# EAGLE design tinyG2Hat (EAGLE 9.0.1)
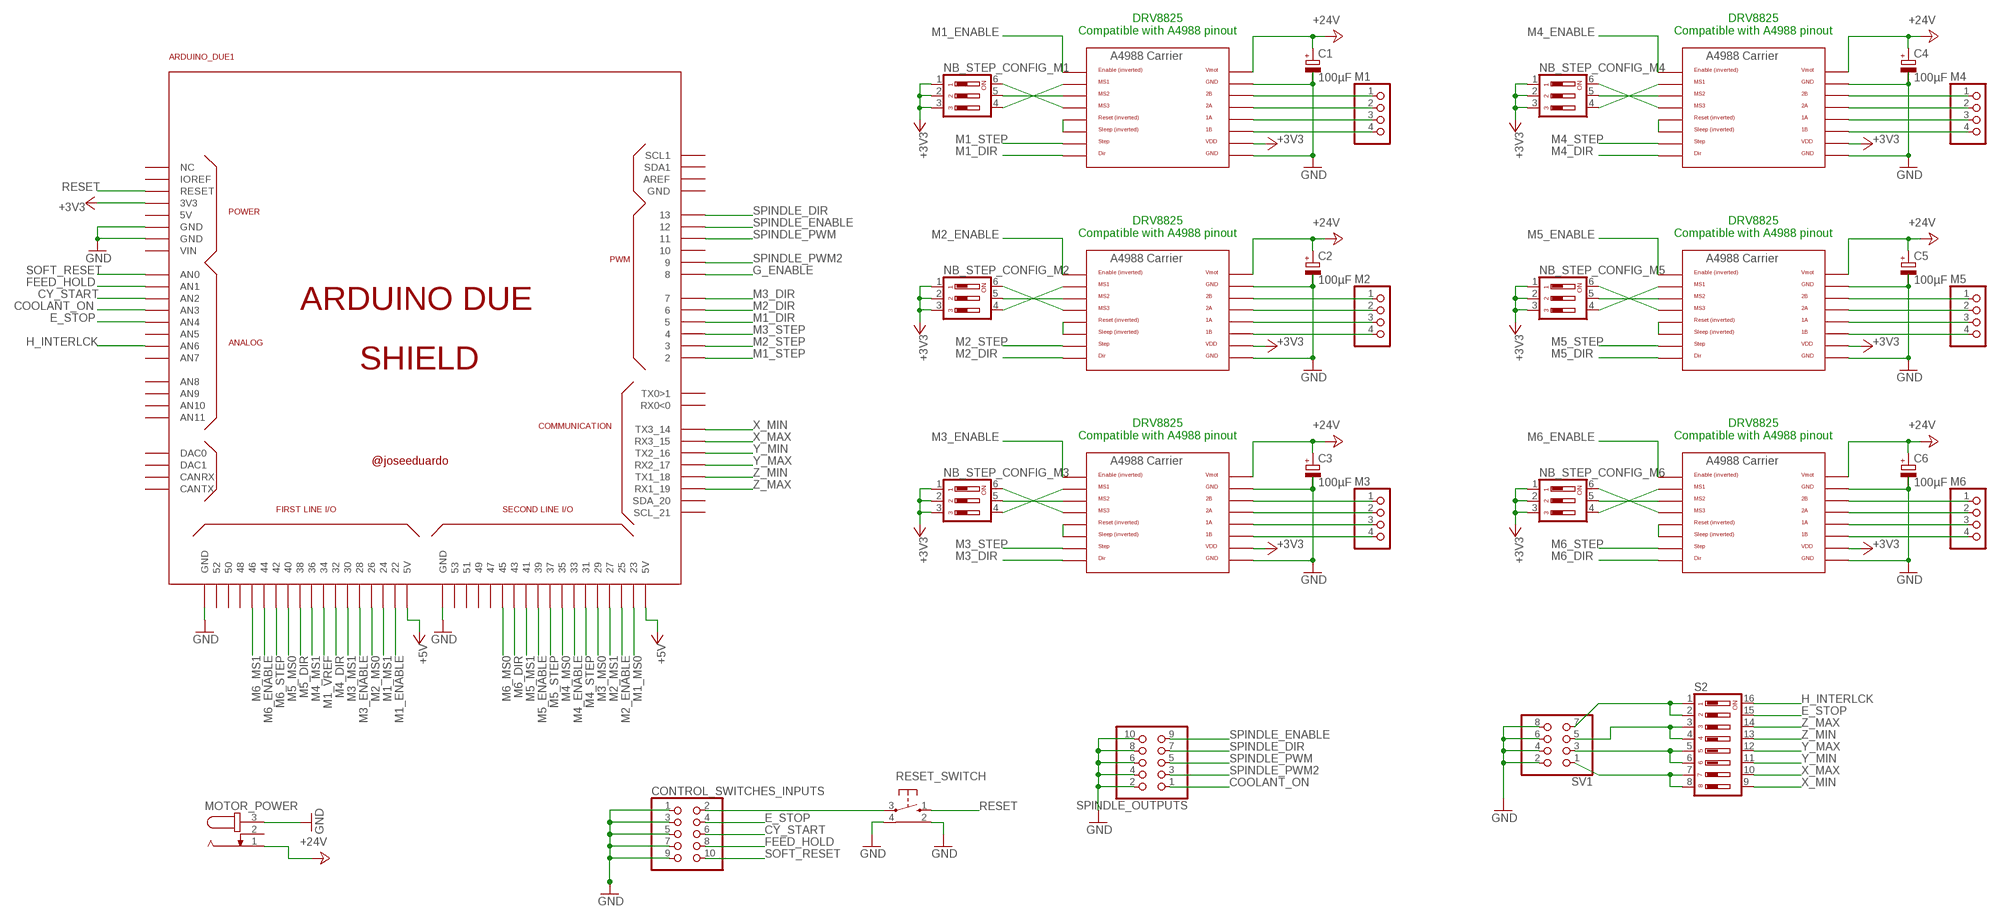
[diagram p0: schematic, sheet 1]

## Parts
ARDUINO_DUE1  ARDUINO_DUE_SHIELD_NOSPI  [ARDUINO_DUE_SHIELD_NOSPI]
C1  100µF  CPOL-EUE3.5-8  [E3,5-8]
C2  100µF  CPOL-EUE3.5-8  [E3,5-8]
C3  100µF  CPOL-EUE3.5-8  [E3,5-8]
C4  100µF  CPOL-EUE3.5-8  [E3,5-8]
C5  100µF  CPOL-EUE3.5-8  [E3,5-8]
C6  100µF  CPOL-EUE3.5-8  [E3,5-8]
CONTROL_SWITCHES_INPUTS  PINHD-2X5  [2X05]
M1  PINHD-1X4  [1X04]
M2  PINHD-1X4  [1X04]
M3  PINHD-1X4  [1X04]
M4  PINHD-1X4  [1X04]
M5  PINHD-1X4  [1X04]
M6  PINHD-1X4  [1X04]
MOTOR_POWER  RAPC7120  [RAPC712]
NB_STEP_CONFIG_M1  DIP03YL  [DIP03YL]
NB_STEP_CONFIG_M2  DIP03YL  [DIP03YL]
NB_STEP_CONFIG_M3  DIP03YL  [DIP03YL]
NB_STEP_CONFIG_M4  DIP03YL  [DIP03YL]
NB_STEP_CONFIG_M5  DIP03YL  [DIP03YL]
NB_STEP_CONFIG_M6  DIP03YL  [DIP03YL]
RESET_SWITCH  10-XX-RPAD  [B3F-10XX-RPAD]
S2  DIP08YL  [DIP08YL]
SPINDLE_OUTPUTS  PINHD-2X5  [2X05]
SV1  PINHD-2X4  [2X04]
U$1  A4988BREAKOUT  [A4988BREAKOUT]
U$2  A4988BREAKOUT  [A4988BREAKOUT]
U$3  A4988BREAKOUT  [A4988BREAKOUT]
U$4  A4988BREAKOUT  [A4988BREAKOUT]
U$5  A4988BREAKOUT  [A4988BREAKOUT]
U$6  A4988BREAKOUT  [A4988BREAKOUT]

## Nets
+3V3: ARDUINO_DUE1.3V3 NB_STEP_CONFIG_M1.1 NB_STEP_CONFIG_M1.2 NB_STEP_CONFIG_M1.3 NB_STEP_CONFIG_M2.1 NB_STEP_CONFIG_M2.2 NB_STEP_CONFIG_M2.3 NB_STEP_CONFIG_M3.1 NB_STEP_CONFIG_M3.2 NB_STEP_CONFIG_M3.3 NB_STEP_CONFIG_M4.1 NB_STEP_CONFIG_M4.2 NB_STEP_CONFIG_M4.3 NB_STEP_CONFIG_M5.1 NB_STEP_CONFIG_M5.2 NB_STEP_CONFIG_M5.3 NB_STEP_CONFIG_M6.1 NB_STEP_CONFIG_M6.2 NB_STEP_CONFIG_M6.3 U$1.VDD U$2.VDD U$3.VDD U$4.VDD U$5.VDD U$6.VDD
+5V: ARDUINO_DUE1.5V0_1(5V) ARDUINO_DUE1.5V0_2(5V)
+24V: C1.+ C2.+ C3.+ C4.+ C5.+ C6.+ MOTOR_POWER.1 U$1.VMOT U$2.VMOT U$3.VMOT U$4.VMOT U$5.VMOT U$6.VMOT
COOLANT_ON: ARDUINO_DUE1.A3(AN3) SPINDLE_OUTPUTS.1
CY_START: ARDUINO_DUE1.A2(AN2) CONTROL_SWITCHES_INPUTS.6
E_STOP: ARDUINO_DUE1.A4(AN4) CONTROL_SWITCHES_INPUTS.4 S2.15
FEED_HOLD: ARDUINO_DUE1.A1(AN1) CONTROL_SWITCHES_INPUTS.8
G_ENABLE: ARDUINO_DUE1.8
GND: ARDUINO_DUE1.GND ARDUINO_DUE1.GND_1(GND) ARDUINO_DUE1.GND_2(GND) ARDUINO_DUE1.GND_3(GND) C1.- C2.- C3.- C4.- C5.- C6.- CONTROL_SWITCHES_INPUTS.1 CONTROL_SWITCHES_INPUTS.3 CONTROL_SWITCHES_INPUTS.5 CONTROL_SWITCHES_INPUTS.7 CONTROL_SWITCHES_INPUTS.9 MOTOR_POWER.3 RESET_SWITCH.2(GND1) RESET_SWITCH.4(GND2) SPINDLE_OUTPUTS.2 SPINDLE_OUTPUTS.4 SPINDLE_OUTPUTS.6 SPINDLE_OUTPUTS.8 SPINDLE_OUTPUTS.10 SV1.2 SV1.4 SV1.6 SV1.8 U$1.GND U$1.GND@0(GND) U$2.GND U$2.GND@0(GND) U$3.GND U$3.GND@0(GND) U$4.GND U$4.GND@0(GND) U$5.GND U$5.GND@0(GND) U$6.GND U$6.GND@0(GND)
H_INTERLCK: ARDUINO_DUE1.A6(AN6) S2.16
M1_DIR: ARDUINO_DUE1.5 U$1.DIR
M1_ENABLE: ARDUINO_DUE1.22 U$1.EN
M1_MS0: ARDUINO_DUE1.23
M1_MS1: ARDUINO_DUE1.24
M1_STEP: ARDUINO_DUE1.2 U$1.STEP
M1_VREF: ARDUINO_DUE1.34
M2_DIR: ARDUINO_DUE1.6 U$2.DIR
M2_ENABLE: ARDUINO_DUE1.25 U$2.EN
M2_MS0: ARDUINO_DUE1.26
M2_MS1: ARDUINO_DUE1.27
M2_STEP: ARDUINO_DUE1.3 U$2.STEP
M3_DIR: ARDUINO_DUE1.7 U$3.DIR
M3_ENABLE: ARDUINO_DUE1.28 U$3.EN
M3_MS0: ARDUINO_DUE1.29
M3_MS1: ARDUINO_DUE1.30
M3_STEP: ARDUINO_DUE1.4 U$3.STEP
M4_DIR: ARDUINO_DUE1.32 U$4.DIR
M4_ENABLE: ARDUINO_DUE1.33 U$4.EN
M4_MS0: ARDUINO_DUE1.35
M4_MS1: ARDUINO_DUE1.36
M4_STEP: ARDUINO_DUE1.31 U$4.STEP
M5_DIR: ARDUINO_DUE1.38 U$5.DIR
M5_ENABLE: ARDUINO_DUE1.39 U$5.EN
M5_MS0: ARDUINO_DUE1.40
M5_MS1: ARDUINO_DUE1.41
M5_STEP: ARDUINO_DUE1.37 U$5.STEP
M6_DIR: ARDUINO_DUE1.43 U$6.DIR
M6_ENABLE: ARDUINO_DUE1.44 U$6.EN
M6_MS0: ARDUINO_DUE1.45
M6_MS1: ARDUINO_DUE1.46
M6_STEP: ARDUINO_DUE1.42 U$6.STEP
N$1: NB_STEP_CONFIG_M1.6 U$1.MS3
N$2: NB_STEP_CONFIG_M1.5 U$1.MS2
N$3: NB_STEP_CONFIG_M1.4 U$1.MS1
N$4: U$1.RST U$1.SLP(SLEEP)
N$5: M1.1 U$1.2B
N$6: M1.2 U$1.2A
N$7: M1.3 U$1.1A
N$8: M1.4 U$1.1B
N$9: NB_STEP_CONFIG_M2.5 U$2.MS2
N$10: U$2.RST U$2.SLP(SLEEP)
N$11: M2.1 U$2.2B
N$12: M2.2 U$2.2A
N$13: M2.3 U$2.1A
N$14: M2.4 U$2.1B
N$15: NB_STEP_CONFIG_M2.6 U$2.MS3
N$16: NB_STEP_CONFIG_M2.4 U$2.MS1
N$17: NB_STEP_CONFIG_M3.5 U$3.MS2
N$18: U$3.RST U$3.SLP(SLEEP)
N$19: M3.1 U$3.2B
N$20: M3.2 U$3.2A
N$21: M3.3 U$3.1A
N$22: M3.4 U$3.1B
N$23: NB_STEP_CONFIG_M3.6 U$3.MS3
N$24: NB_STEP_CONFIG_M3.4 U$3.MS1
N$25: NB_STEP_CONFIG_M4.5 U$4.MS2
N$26: U$4.RST U$4.SLP(SLEEP)
N$27: M4.1 U$4.2B
N$28: M4.2 U$4.2A
N$29: M4.3 U$4.1A
N$30: M4.4 U$4.1B
N$31: NB_STEP_CONFIG_M4.6 U$4.MS3
N$32: NB_STEP_CONFIG_M4.4 U$4.MS1
N$33: NB_STEP_CONFIG_M5.5 U$5.MS2
N$34: U$5.RST U$5.SLP(SLEEP)
N$35: M5.1 U$5.2B
N$36: M5.2 U$5.2A
N$37: M5.3 U$5.1A
N$38: M5.4 U$5.1B
N$39: NB_STEP_CONFIG_M5.6 U$5.MS3
N$40: NB_STEP_CONFIG_M5.4 U$5.MS1
N$41: NB_STEP_CONFIG_M6.5 U$6.MS2
N$42: U$6.RST U$6.SLP(SLEEP)
N$43: M6.1 U$6.2B
N$44: M6.2 U$6.2A
N$45: M6.3 U$6.1A
N$46: M6.4 U$6.1B
N$47: NB_STEP_CONFIG_M6.6 U$6.MS3
N$48: NB_STEP_CONFIG_M6.4 U$6.MS1
N$49: S2.1 S2.2 SV1.7
N$50: CONTROL_SWITCHES_INPUTS.2 RESET_SWITCH.3(P)
N$51: S2.3 S2.4 SV1.5
N$53: S2.5 S2.6 SV1.3
N$55: S2.7 S2.8 SV1.1
RESET: ARDUINO_DUE1.RESET RESET_SWITCH.1(S)
SOFT_RESET: ARDUINO_DUE1.A0(AN0) CONTROL_SWITCHES_INPUTS.10
SPINDLE_DIR: ARDUINO_DUE1.13 SPINDLE_OUTPUTS.7
SPINDLE_ENABLE: ARDUINO_DUE1.12 SPINDLE_OUTPUTS.9
SPINDLE_PWM: ARDUINO_DUE1.11 SPINDLE_OUTPUTS.5
SPINDLE_PWM2: ARDUINO_DUE1.9 SPINDLE_OUTPUTS.3
X_MAX: ARDUINO_DUE1.15(RX3_15) S2.10
X_MIN: ARDUINO_DUE1.14(TX3_14) S2.9
Y_MAX: ARDUINO_DUE1.17(RX2_17) S2.12
Y_MIN: ARDUINO_DUE1.16(TX2_16) S2.11
Z_MAX: ARDUINO_DUE1.19(RX1_19) S2.14
Z_MIN: ARDUINO_DUE1.18(TX1_18) S2.13
Unconnected: ARDUINO_DUE1.0(RX0<0) ARDUINO_DUE1.1(TX0>1) ARDUINO_DUE1.5V0(5V) ARDUINO_DUE1.10 ARDUINO_DUE1.20(SDA_20) ARDUINO_DUE1.21(SCL_21) ARDUINO_DUE1.47 ARDUINO_DUE1.48 ARDUINO_DUE1.49 ARDUINO_DUE1.50 ARDUINO_DUE1.51 ARDUINO_DUE1.52 ARDUINO_DUE1.53 ARDUINO_DUE1.A5(AN5) ARDUINO_DUE1.A7(AN7) ARDUINO_DUE1.A8(AN8) ARDUINO_DUE1.A9(AN9) ARDUINO_DUE1.A10(AN10) ARDUINO_DUE1.A11(AN11) ARDUINO_DUE1.AREF ARDUINO_DUE1.CANRX ARDUINO_DUE1.CANTX ARDUINO_DUE1.DAC0 ARDUINO_DUE1.DAC1 ARDUINO_DUE1.GND_4(GND) ARDUINO_DUE1.IOREF ARDUINO_DUE1.NC_2(NC) ARDUINO_DUE1.SCL1 ARDUINO_DUE1.SDA1 ARDUINO_DUE1.VIN MOTOR_POWER.2

## Notes on the sheet
- DRV8825
  Compatible with A4988 pinout
- DRV8825
  Compatible with A4988 pinout
- DRV8825
  Compatible with A4988 pinout
- DRV8825
  Compatible with A4988 pinout
- DRV8825
  Compatible with A4988 pinout
- DRV8825
  Compatible with A4988 pinout

## Library data of the parts
ARDUINO_DUE1 = arduino_due_shield:ARDUINO_DUE_SHIELD_NOSPI
C1-C6 = rcl:CPOL-EU: POLARIZED CAPACITOR, European symbol; SPICEPREFIX: C
CONTROL_SWITCHES_INPUTS SPINDLE_OUTPUTS = pinhead:PINHD-2X5: PIN HEADER
M1-M6 = pinhead:PINHD-1X4: PIN HEADER
MOTOR_POWER = RepRapjr:RAPC712: DC POWER JACK Power Jack, DC, Right Angle, Through Hole, Rated 5A at 16VDC, PC Terminals Distributor: Farnell (www.Farnell.de) Drawing: 84N1161.pdf / 84N1162.pdf Manufacturer: SPC Technology (www.spctechnology.com) Type: SPC4077 / SPC 4078
NB_STEP_CONFIG_M1-NB_STEP_CONFIG_M6 = switch-dil:DIP03YL: DIL/CODE SWITCH; OC_FARNELL: unknown; OC_NEWARK: unknown
RESET_SWITCH = RepRapjr:10-XX-RPAD: OMRON SWITCH
S2 = switch-dil:DIP08YL: DIL/CODE SWITCH; OC_FARNELL: unknown; OC_NEWARK: unknown
SV1 = pinhead:PINHD-2X4: PIN HEADER
U$1-U$6 = RepRapjr:A4988BREAKOUT

## Board
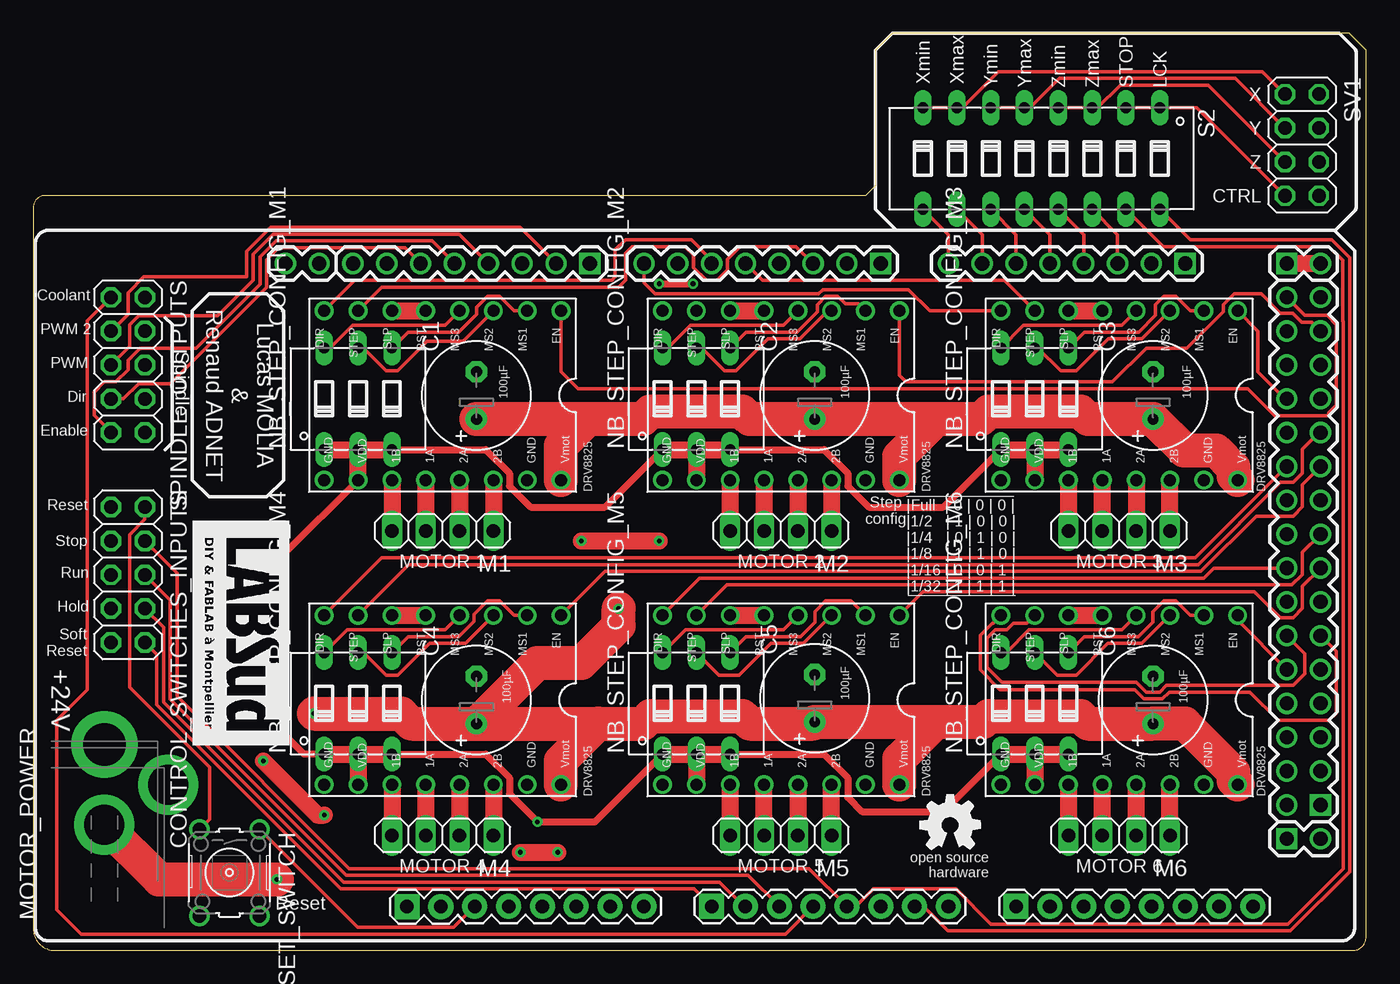
[diagram p1: board, top side]
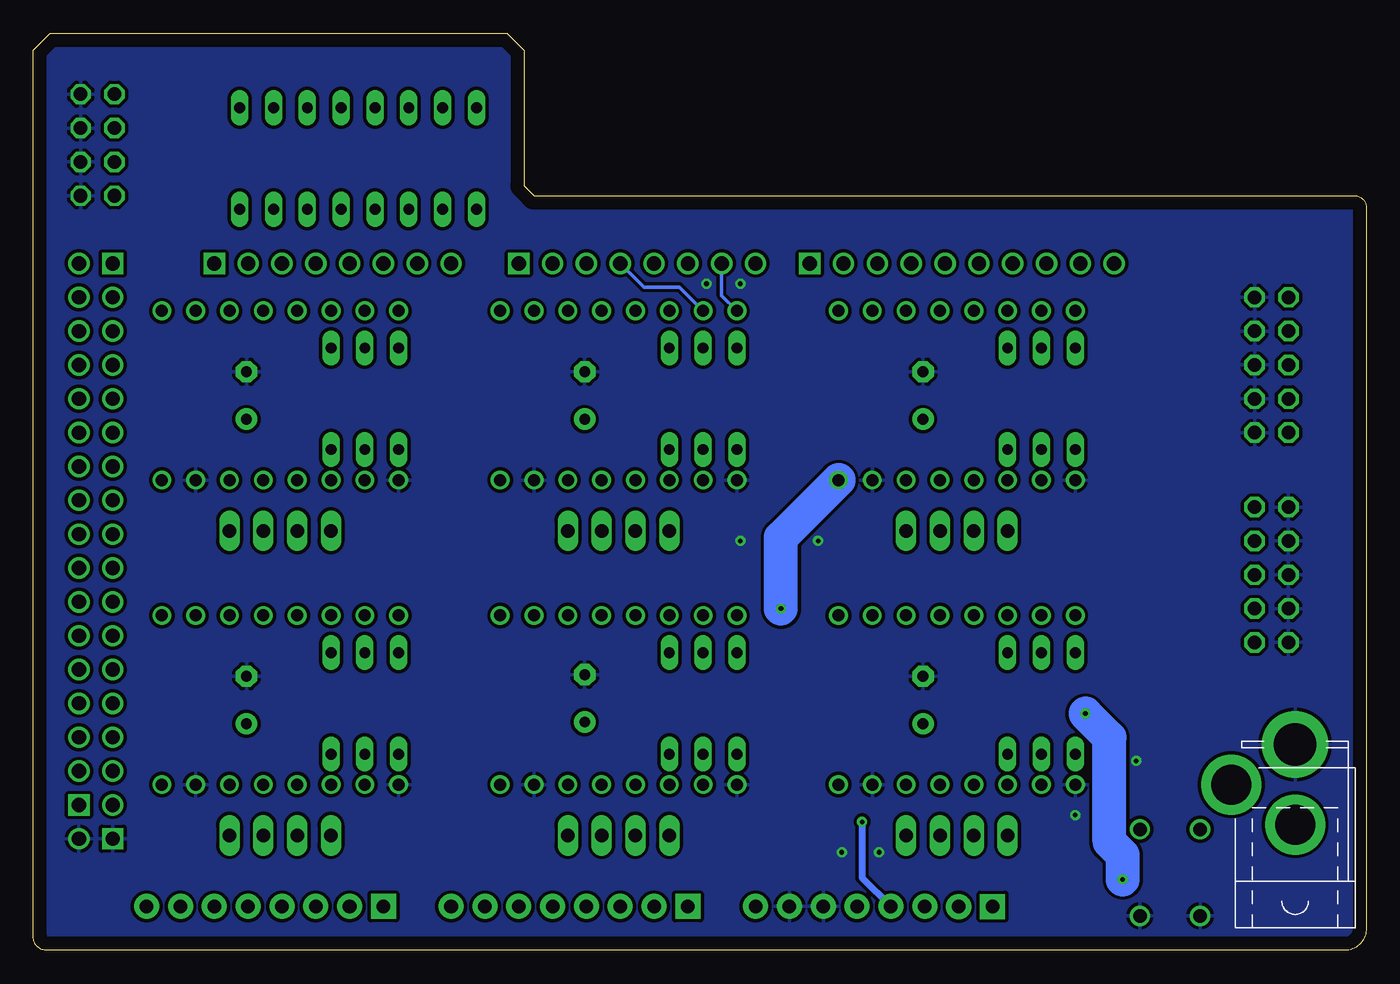
[diagram p2: board, bottom side, seen from below]

Size 100.08 x 68.84 mm. Coordinates in mm from the lower left corner, seen from the top.
Outline: 0,55.88 0,1.53 arc90 1.78,0 99.06,0 arc90 100.08,1.02 100.08,67.57 98.81,68.84 64.52,68.84 63.25,67.57 63.25,57.41 62.48,56.65 1.02,56.65 arc90 0,55.88
Copper layers (1*16): Top 0.035mm / dielectric 1.5mm / Bottom 0.035mm
Design rules "default *": minimum track width 6mil, minimum drill 0.35mm, track to track 10mil, track to pad 10mil, pad to pad 10mil, via to via 10mil, smd to smd 10mil, copper to edge 40mil, drill to drill 6mil, minimum pad ring 10mil, minimum via ring 8mil, stop-mask expansion 4mil, vias tented up to drill 0mil, thermal gap 10mil

### Footprints (pad centres in the part's own frame; a part is rotated, then mirrored left to right if it is on the bottom)
ARDUINO_DUE_SHIELD_NOSPI = drill 1.067 square: 0 63.373,51.816; 5V0_1 93.853,51.816; 8 41.529,51.816; 21 86.233,51.816; 53 96.393,11.176; GND_2 93.853,8.636 | drill 1.067: 1 60.833,51.816; 2 58.293,51.816; 3 55.753,51.816; 4 53.213,51.816; 5 50.673,51.816; 5V0_2 96.393,51.816; 6 48.133,51.816; 7 45.593,51.816; 9 38.989,51.816; 10 36.449,51.816; 11 33.909,51.816; 12 31.369,51.816; 13 28.829,51.816; 14 68.453,51.816; 15 70.993,51.816; 16 73.533,51.816; 17 76.073,51.816; 18 78.613,51.816; 19 81.153,51.816; 20 83.693,51.816; 22 93.853,49.276; 23 96.393,49.276; 24 93.853,46.736; 25 96.393,46.736; 26 93.853,44.196; 27 96.393,44.196; 28 93.853,41.656; 29 96.393,41.656; 30 93.853,39.116; 31 96.393,39.116; 32 93.853,36.576; 33 96.393,36.576; 34 93.853,34.036; 35 96.393,34.036; 36 93.853,31.496; 37 96.393,31.496; 38 93.853,28.956; 39 96.393,28.956; 40 93.853,26.416; 41 96.393,26.416; 42 93.853,23.876; 43 96.393,23.876; 44 93.853,21.336; 45 96.393,21.336; 46 93.853,18.796; 47 96.393,18.796; 48 93.853,16.256; 49 96.393,16.256; 50 93.853,13.716; 51 96.393,13.716; 52 93.853,11.176; AREF 23.749,51.816; GND_3 96.393,8.636; GND_4 26.289,51.816; SCL1 18.669,51.816; SDA1 21.209,51.816 | drill 1.016 pad 1.88: 3V3 35.433,3.556; 5V0 37.973,3.556; A1 53.213,3.556; A2 55.753,3.556; A3 58.293,3.556; A4 60.833,3.556; A5 63.373,3.556; A6 65.913,3.556; A7 68.453,3.556; A9 76.073,3.556; A10 78.613,3.556; A11 81.153,3.556; CANRX 88.773,3.556; CANTX 91.313,3.556; DAC0 83.693,3.556; DAC1 86.233,3.556; GND 40.513,3.556; GND_1 43.053,3.556; IOREF 30.346,3.543; RESET 32.893,3.555; VIN 45.593,3.556 | drill 1.016 pad 1.88 square: A0 50.673,3.556; A8 73.533,3.556; NC_2 27.806,3.543
E3,5-8 = drill 0.813 pad 1.6: + -1.778,0 | drill 0.813 pad 1.6 octagon: - 1.778,0
2X05 = drill 1.016 octagon: 1 -5.08,-1.27; 2 -5.08,1.27; 3 -2.54,-1.27; 4 -2.54,1.27; 5 0,-1.27; 6 0,1.27; 7 2.54,-1.27; 8 2.54,1.27; 9 5.08,-1.27; 10 5.08,1.27
1X04 = drill 1.016 long: 1 -3.81,0; 2 -1.27,0; 3 1.27,0; 4 3.81,0
RAPC712 = drill 3 pad 4.5: 1 -3,0; 2 0,-4.8 | drill 3.2 pad 5: 3 3,0
DIP03YL = drill 0.813 long: 1 -2.54,-3.81; 2 0,-3.81; 3 2.54,-3.81; 4 2.54,3.81; 5 0,3.81; 6 -2.54,3.81
B3F-10XX-RPAD = drill 1.016: 1 -3.251,2.261; 2 3.251,2.261; 3 -3.251,-2.261; 4 3.251,-2.261
DIP08YL = drill 0.813 long: 1 -8.89,-3.81; 2 -6.35,-3.81; 3 -3.81,-3.81; 4 -1.27,-3.81; 5 1.27,-3.81; 6 3.81,-3.81; 7 6.35,-3.81; 8 8.89,-3.81; 9 8.89,3.81; 10 6.35,3.81; 11 3.81,3.81; 12 1.27,3.81; 13 -1.27,3.81; 14 -3.81,3.81; 15 -6.35,3.81; 16 -8.89,3.81
2X04 = drill 1.016 octagon: 1 -3.81,-1.27; 2 -3.81,1.27; 3 -1.27,-1.27; 4 -1.27,1.27; 5 1.27,-1.27; 6 1.27,1.27; 7 3.81,-1.27; 8 3.81,1.27
A4988BREAKOUT = drill 0.9: 1A 8.89,1.27; 1B 11.43,1.27; 2A 6.35,1.27; 2B 3.81,1.27; DIR 16.51,-11.43; EN -1.27,-11.43; GND 16.51,1.27; GND@0 1.27,1.27; MS1 1.27,-11.43; MS2 3.81,-11.43; MS3 6.35,-11.43; RST 8.89,-11.43; SLP 11.43,-11.43; STEP 13.97,-11.43; VDD 13.97,1.27; VMOT -1.27,1.27

### Placement (x,y rotation side)
ARDUINO_DUE1  0.25,-0.25 0 top
C1  33.27,41.66 90 top
C2  58.67,41.66 90 top
C3  84.07,41.66 90 top
C4  33.27,18.8 90 top
C5  58.67,18.93 90 top
C6  84.07,18.8 90 top
CONTROL_SWITCHES_INPUTS  7.11,28.2 270 top
M1  30.73,31.5 180 top
M2  56.13,31.5 180 top
M3  81.53,31.5 180 top
M4  30.73,8.64 180 top
M5  56.13,8.64 180 top
M6  81.53,8.64 180 top
MOTOR_POWER  5.33,12.45 90 top
NB_STEP_CONFIG_M1  24.38,41.41 0 top
NB_STEP_CONFIG_M2  49.78,41.41 0 top
NB_STEP_CONFIG_M3  75.18,41.41 0 top
NB_STEP_CONFIG_M4  24.38,18.55 0 top
NB_STEP_CONFIG_M5  49.78,18.55 0 top
NB_STEP_CONFIG_M6  75.18,18.55 0 top
RESET_SWITCH  14.73,5.85 270 top
S2  75.69,59.44 180 top
SPINDLE_OUTPUTS  7.11,43.95 270 top
SV1  95.25,60.46 270 top
U$1  38.35,36.58 180 top
U$2  63.75,36.58 180 top
U$3  89.15,36.58 180 top
U$4  38.35,13.72 180 top
U$5  63.75,13.72 180 top
U$6  89.15,13.72 180 top
U$7  [OPEN_HARDWARE_5MM]  68.83,9.4 0 top
U$8  [LABSUD_15MM]  11.94,32.26 270 top

### Tracks (layer width: path | path; a pad name or v marks a point on that pad's centre or on a via)
+3V3  (via drill 0.35)
  Top 0.508: NB_STEP_CONFIG_M1.3 33.97,37.6 35.76,35.81 35.76,34.86 37.34,33.28 42.93,33.28 NB_STEP_CONFIG_M2.1 | NB_STEP_CONFIG_M2.3 59.37,37.6 61.16,35.81 61.16,34.86 62.74,33.28 68.33,33.28 NB_STEP_CONFIG_M3.1 | NB_STEP_CONFIG_M4.1 20.32,14.74 18.8,16.26 18.8,29.72 U$1.VDD | NB_STEP_CONFIG_M4.3 33.97,14.74 35.76,12.95 35.76,11.75 v37.85,9.66 42.16,9.66 NB_STEP_CONFIG_M5.1 | NB_STEP_CONFIG_M5.3 59.37,14.74 61.16,12.95 61.16,11.49 62.23,10.42 68.33,10.42 NB_STEP_CONFIG_M6.1
  Top 1.27: U$1.VDD NB_STEP_CONFIG_M1.2 | NB_STEP_CONFIG_M1.1 NB_STEP_CONFIG_M1.2 | NB_STEP_CONFIG_M1.2 NB_STEP_CONFIG_M1.3 | NB_STEP_CONFIG_M2.1 NB_STEP_CONFIG_M2.2 | NB_STEP_CONFIG_M2.2 NB_STEP_CONFIG_M2.3 | NB_STEP_CONFIG_M2.2 U$2.VDD | NB_STEP_CONFIG_M3.1 NB_STEP_CONFIG_M3.2 | NB_STEP_CONFIG_M3.2 NB_STEP_CONFIG_M3.3 | NB_STEP_CONFIG_M3.2 U$3.VDD | NB_STEP_CONFIG_M4.1 NB_STEP_CONFIG_M4.2 | NB_STEP_CONFIG_M4.2 NB_STEP_CONFIG_M4.3 | NB_STEP_CONFIG_M4.2 U$4.VDD | NB_STEP_CONFIG_M5.1 NB_STEP_CONFIG_M5.2 | NB_STEP_CONFIG_M5.2 NB_STEP_CONFIG_M5.3 | NB_STEP_CONFIG_M5.2 U$5.VDD | NB_STEP_CONFIG_M6.1 NB_STEP_CONFIG_M6.2 | NB_STEP_CONFIG_M6.2 NB_STEP_CONFIG_M6.3 | NB_STEP_CONFIG_M6.2 U$6.VDD
  Bottom 0.508: v37.85,9.66 37.85,5.47 ARDUINO_DUE1.3V3
+5V
  Top 1.27: ARDUINO_DUE1.5V0_1 ARDUINO_DUE1.5V0_2
+24V  (via drill 0.35)
  Top 2.54: 41.66,39.88 45.78,39.88 46.34,40.44 53.23,40.44 53.79,39.88 C2.+ 67.82,39.88 | 41.66,39.88 C1.+ | 67.82,39.88 71.18,39.88 71.74,40.44 78.63,40.44 79.19,39.88 C3.+ 86.42,37.54 88.81,37.54 90.11,36.23 90.11,35.62 U$3.VMOT | C4.+ 37.85,21.59 41.15,21.59 43.94,24.39 v43.94,25.66 | C4.+ 42.42,17.02 | 42.42,17.02 45.78,17.02 46.34,17.58 53.23,17.58 53.79,17.02 58.55,17.02 C5.+ 67.82,17.15 | U$6.VMOT 90.11,12.76 90.11,13.37 86.46,17.02 C6.+ 79.19,17.02 78.63,17.58 71.74,17.58 71.31,17.15 67.82,17.15 | MOTOR_POWER.1 9.45,5.34 v18.29,5.34 | C4.+ 28.39,17.02 27.63,17.78 v21.08,17.78 | U$1.VMOT 39.62,37.85 41.66,39.88 | U$2.VMOT 65.02,37.09 67.82,39.88 | U$4.VMOT 39.62,14.23 42.42,17.02 | U$5.VMOT 65.02,14.36 67.82,17.15
  Bottom 2.54: v18.29,5.34 18.29,7.16 19.28,8.15 19.28,15.98 v21.08,17.78 | v43.94,25.66 43.94,30.99 U$1.VMOT
COOLANT_ON
  Top 0.254: SPINDLE_OUTPUTS.1 4.06,47.25 4.06,19.56 1.78,17.28 1.78,3.05 3.61,1.22 56.46,1.22 ARDUINO_DUE1.A3
CY_START
  Top 0.254: CONTROL_SWITCHES_INPUTS.6 10.29,26.29 10.29,18.86 23.5,5.64 53.67,5.64 ARDUINO_DUE1.A2
E_STOP
  Top 0.254: CONTROL_SWITCHES_INPUTS.4 10.79,28.33 10.79,19.07 23.71,6.15 58.24,6.15 ARDUINO_DUE1.A4 61.76,3.31 63.08,4.63 69.25,4.63 71.9,1.99 94.18,1.99 98.34,6.14 98.34,47.19 98.3,47.22 98.3,51.82 97.28,52.84 84.84,52.84 S2.15
FEED_HOLD
  Top 0.254: CONTROL_SWITCHES_INPUTS.8 9.78,24.26 9.78,18.65 23.29,5.14 51.52,5.14 53.34,3.31 ARDUINO_DUE1.A1
GND  (via drill 0.35)
  Top 0.508: v46.99,50.04 v49.53,50.04
  Top 1.27: v17.27,14.23 21.34,10.16 v21.84,10.16 | v41.15,30.74 v46.99,30.74 | v36.58,7.37 v39.37,7.37
  pour Bottom: -5.59,78.24 -5.33,-3.04 104.39,-2.79 104.14,78.49
H_INTERLCK
  Top 0.254: ARDUINO_DUE1.A6 66.84,3.31 68.67,1.48 94.39,1.48 98.84,5.93 98.84,51.99 97.49,53.34 86.87,53.34 S2.16
M1_DIR
  Top 0.254: ARDUINO_DUE1.5 50.93,51.82 49.4,53.34 44.45,53.34 43.69,52.58 43.69,50.55 43.43,50.3 24.13,50.3 U$1.DIR
M1_ENABLE
  Top 0.254: U$1.EN 39.62,43.44 40.89,42.17 91.19,42.17 93.22,40.14 97.28,40.14 97.28,40.37 97.83,40.92 97.83,46.98 97.14,47.67 95.47,47.67 ARDUINO_DUE1.22
M1_STEP
  Top 0.254: ARDUINO_DUE1.2 57.28,52.84 53.07,52.84 52.11,51.88 52.11,51.08 51.42,50.39 51.4,50.39 51.31,50.3 50.53,50.3 49.57,51.26 49.57,52.21 48.94,52.84 44.96,52.84 44.45,52.33 44.45,50.3 43.94,49.79 26.16,49.79 U$1.STEP
M2_DIR
  Bottom 0.254: U$2.DIR 48.39,49.15 ARDUINO_DUE1.6
M2_ENABLE
  Top 0.254: U$2.EN 65.02,43.18 65.53,42.68 81.03,42.68 83.57,45.22 86.62,45.22 89.34,47.93 89.34,48.46 89.98,49.1 90.17,49.28 92.18,49.28 93.62,47.85 94.57,47.85 95.26,47.16 95.97,47.16 ARDUINO_DUE1.25
M2_STEP
  Bottom 0.254: U$2.STEP 51.56,49.79 54.23,49.79 ARDUINO_DUE1.3
M3_DIR
  Top 0.254: U$3.DIR 67.31,48.01 65.72,49.6 59.28,49.6 58.96,49.28 46.68,49.28 45.85,50.11 ARDUINO_DUE1.7
M3_ENABLE
  Top 0.254: U$3.EN 91.95,46.49 91.95,43.44 93.98,41.41 ARDUINO_DUE1.28
M3_STEP
  Top 0.254: ARDUINO_DUE1.4 54.74,50.3 72.9,50.3 U$3.STEP
M4_DIR
  Top 0.254: U$4.DIR 26.16,29.47 87.25,29.47 ARDUINO_DUE1.32
M4_ENABLE
  Top 0.254: U$4.EN 42.93,28.45 87.67,28.45 91.82,32.61 94.6,32.61 95.29,33.3 95.29,34.97 ARDUINO_DUE1.33
M4_STEP
  Top 0.254: U$4.STEP 28.19,28.96 87.46,28.96 93.64,35.15 94.6,35.15 95.29,35.84 95.29,37.63 96.52,38.87 ARDUINO_DUE1.31
M5_DIR
  Top 0.254: U$5.DIR 50.04,27.94 87.88,27.94 88.64,28.71 ARDUINO_DUE1.38
M5_ENABLE
  Top 0.254: U$5.EN 66.8,26.93 91.68,26.93 93.62,24.99 94.6,24.99 95.29,25.68 95.29,27.35 ARDUINO_DUE1.39
M5_STEP
  Top 0.254: U$5.STEP 52.07,27.44 94.51,27.44 95.29,28.22 95.29,29.89 ARDUINO_DUE1.37
M6_DIR
  Top 0.254: U$6.DIR 72.07,24.57 72.01,24.57 71.09,23.66 71.09,21.05 72.59,19.56 82.7,19.56 83.37,18.89 84.77,18.89 85.28,19.4 91.35,19.4 93.47,17.28 97.28,17.28 97.83,17.82 97.83,22.45 ARDUINO_DUE1.43
M6_ENABLE
  Top 0.254: U$6.EN 90.42,24.77 ARDUINO_DUE1.44
M6_STEP
  Top 0.254: U$6.STEP 74.6,24.57 73.59,24.57 73.09,24.07 72.22,24.07 71.6,23.45 71.6,21.26 72.72,20.15 82.84,20.15 83.59,19.4 84.56,19.4 85.07,19.91 94.6,19.91 95.47,20.78 95.47,22.27 ARDUINO_DUE1.42
N$1
  Top 0.254: NB_STEP_CONFIG_M1.6 22.25,45.22 23.96,46.93 30.92,46.93 U$1.MS3
N$2
  Top 0.254: NB_STEP_CONFIG_M1.5 24.79,45.22 26.49,43.51 27.36,43.51 29.57,45.72 32.26,45.72 U$1.MS2
N$3
  Top 0.254: U$1.MS1 36.08,48.01 34.99,49.1 34.09,49.1 33.28,48.29 33.28,47.76 31.95,46.42 28.12,46.42 NB_STEP_CONFIG_M1.4
N$4
  Top 1.27: U$1.SLP U$1.RST
N$5
  Top 1.27: U$1.2B M1.1
N$6
  Top 1.27: U$1.2A M1.2
N$7
  Top 1.27: U$1.1A M1.3
N$8
  Top 1.27: U$1.1B M1.4
N$9
  Top 0.254: NB_STEP_CONFIG_M2.5 50.19,45.22 51.89,43.51 52.75,43.51 55.15,45.91 57.56,45.91 59.66,48.01 U$2.MS2
N$10
  Top 1.27: U$2.SLP U$2.RST
N$11
  Top 1.27: U$2.2B M2.1
N$12
  Top 1.27: U$2.2A M2.2
N$13
  Top 1.27: U$2.1A M2.3
N$14
  Top 1.27: U$2.1B M2.4
N$15
  Top 0.254: U$2.MS3 56.32,46.93 49.34,46.93 47.63,45.22 NB_STEP_CONFIG_M2.6
N$16
  Top 0.254: NB_STEP_CONFIG_M2.4 53.52,46.42 57.34,46.42 58.49,47.56 58.49,47.57 58.86,47.94 58.86,48.46 59.49,49.1 60.39,49.1 60.96,48.52 61.97,48.52 U$2.MS1
N$17
  Top 0.254: U$3.MS2 83.24,45.91 80.7,45.91 78.31,43.51 77.14,43.51 75.44,45.22 NB_STEP_CONFIG_M3.5
N$18
  Top 1.27: U$3.SLP U$3.RST
N$19
  Top 1.27: M3.1 U$3.2B
N$20
  Top 1.27: U$3.2A M3.2
N$21
  Top 1.27: M3.3 U$3.1A
N$22
  Top 1.27: U$3.1B M3.4
N$23
  Top 0.254: NB_STEP_CONFIG_M3.6 74.35,46.93 81.72,46.93 U$3.MS3
N$24
  Top 0.254: U$3.MS1 86.88,48.01 85.79,49.1 84.9,49.1 84.26,48.46 84.26,47.69 82.99,46.42 78.93,46.42 NB_STEP_CONFIG_M3.4
N$25
  Top 0.254: U$4.MS2 32.44,23.05 29.75,23.05 27.36,20.65 26.49,20.65 24.79,22.36 NB_STEP_CONFIG_M4.5
N$26
  Top 1.27: U$4.SLP U$4.RST
N$27
  Top 1.27: U$4.2B M4.1
N$28
  Top 1.27: U$4.2A M4.2
N$29
  Top 1.27: U$4.1A M4.3
N$30
  Top 1.27: U$4.1B M4.4
N$31
  Top 0.254: NB_STEP_CONFIG_M4.6 23.55,24.07 30.92,24.07 U$4.MS3
N$32
  Top 0.254: U$4.MS1 36.08,25.15 34.99,26.24 34.09,26.24 33.09,25.23 33.09,24.7 31.95,23.56 28.12,23.56 NB_STEP_CONFIG_M4.4
N$33
  Top 0.254: U$5.MS2 57.84,23.05 55.37,23.05 52.98,20.65 51.49,20.65 NB_STEP_CONFIG_M5.5
N$34
  Top 1.27: U$5.SLP U$5.RST
N$35
  Top 1.27: M5.1 U$5.2B
N$36
  Top 1.27: U$5.2A M5.2
N$37
  Top 1.27: M5.3 U$5.1A
N$38
  Top 1.27: U$5.1B M5.4
N$39
  Top 0.254: NB_STEP_CONFIG_M5.6 48.95,24.07 56.32,24.07 U$5.MS3
N$40
  Top 0.254: U$5.MS1 61.4,26.24 59.49,26.24 58.67,25.41 58.67,24.64 57.59,23.56 53.52,23.56 NB_STEP_CONFIG_M5.4
N$41
  Top 0.254: U$6.MS2 83.24,23.04 80.7,23.04 78.31,20.65 76.89,20.65 NB_STEP_CONFIG_M6.5
N$42
  Top 1.27: U$6.SLP U$6.RST
N$43
  Top 1.27: M6.1 U$6.2B
N$44
  Top 1.27: M6.2 U$6.2A
N$45
  Top 1.27: M6.3 U$6.1A
N$46
  Top 1.27: U$6.1B M6.4
N$47
  Top 0.254: NB_STEP_CONFIG_M6.6 73.05,22.36 74.75,24.06 81.71,24.06 U$6.MS3
N$48
  Top 0.254: U$6.MS1 86.88,25.15 85.79,26.24 84.9,26.24 84.07,25.41 84.07,24.64 82.98,23.55 78.92,23.55 NB_STEP_CONFIG_M6.4
N$49
  Top 0.254: S2.2 S2.1 87.38,63.25 SV1.7
N$50
  Top 0.254: RESET_SWITCH.3 13.24,9.86 13.24,13.75 7.24,19.75 7.24,31.21 8.38,32.35 CONTROL_SWITCHES_INPUTS.2
N$51
  Top 0.254: S2.4 S2.3 79.91,63.25 81.61,64.95 88.21,64.95 SV1.5
N$53
  Top 0.254: S2.6 S2.5 74.83,63.25 77.04,65.46 90.25,65.46 SV1.3
N$55
  Top 0.254: S2.8 S2.7 69.75,63.25 72.47,65.97 92.28,65.97 SV1.1
RESET
  Top 0.254: RESET_SWITCH.1 24.36,1.73 31.57,1.73 ARDUINO_DUE1.RESET
SOFT_RESET
  Top 0.254: ARDUINO_DUE1.A0 49.61,4.63 23.08,4.63 9.27,18.44 9.27,22.23 CONTROL_SWITCHES_INPUTS.10
SPINDLE_DIR
  Top 0.254: ARDUINO_DUE1.13 27.9,52.75 18.43,52.75 17.53,51.84 17.53,49.79 10.29,42.55 7.91,42.55 6.77,41.41 SPINDLE_OUTPUTS.7
SPINDLE_ENABLE
  Top 0.254: SPINDLE_OUTPUTS.9 5.89,38.87 4.57,40.18 4.57,41.91 5.33,42.68 6.19,42.68 7.11,43.6 7.11,44.29 8.04,45.22 12.24,45.22 17.02,50 17.02,52.05 18.22,53.26 28.96,53.26 29.06,53.26 29.93,53.26 ARDUINO_DUE1.12
SPINDLE_PWM
  Top 0.254: SPINDLE_OUTPUTS.5 7.24,45.34 7.24,46.96 7.91,47.63 13.84,47.63 16.51,50.3 16.51,52.26 18.01,53.76 31.97,53.76 ARDUINO_DUE1.11
SPINDLE_PWM2
  Top 0.254: SPINDLE_OUTPUTS.3 7.11,47.76 7.11,49.37 8.29,50.55 16,50.55 16,52.47 17.8,54.27 33.02,54.27 33.13,54.27 36.54,54.27 ARDUINO_DUE1.9
X_MAX
  Top 0.254: ARDUINO_DUE1.15 71.25,53.73 S2.10
X_MIN
  Top 0.254: ARDUINO_DUE1.14 68.71,53.73 S2.9
Y_MAX
  Top 0.254: ARDUINO_DUE1.17 76.33,53.73 S2.12
Y_MIN
  Top 0.254: ARDUINO_DUE1.16 73.79,53.73 S2.11
Z_MAX
  Top 0.254: ARDUINO_DUE1.19 81.41,53.73 S2.14
Z_MIN
  Top 0.254: ARDUINO_DUE1.18 78.87,53.73 S2.13

### Text on the board
tPlace: Xmin | Xmax | Ymin | Ymax | Zmin | Zmax | STOP | LCK | X | Y | Z | CTRL | Coolant | PWM 2 | Spindle | PWM | 100µF | 100µF | 100µF | Lucas MOLIA / & / Renaud ADNET | Dir | Enable | DRV8825 | DRV8825 | DRV8825 | Reset | Step / config | Stop | MOTOR 1 | MOTOR 2 | MOTOR 3 | Run | ____________ / |Full | 0 | 0 | 0 | / |1/2 | 1 | 0 | 0 | / |1/4 | 0 | 1 | 0 | / |1/8 | 1 | 1 | 0 | / |1/16 | 0 | 0 | 1 | / |1/32 | 1 | 1 | 1 | | ____________ | Hold | Soft / Reset | 100µF | 100µF | 100µF | +24V | DRV8825 | DRV8825 | DRV8825 | MOTOR 4 | MOTOR 5 | MOTOR 6 | Reset